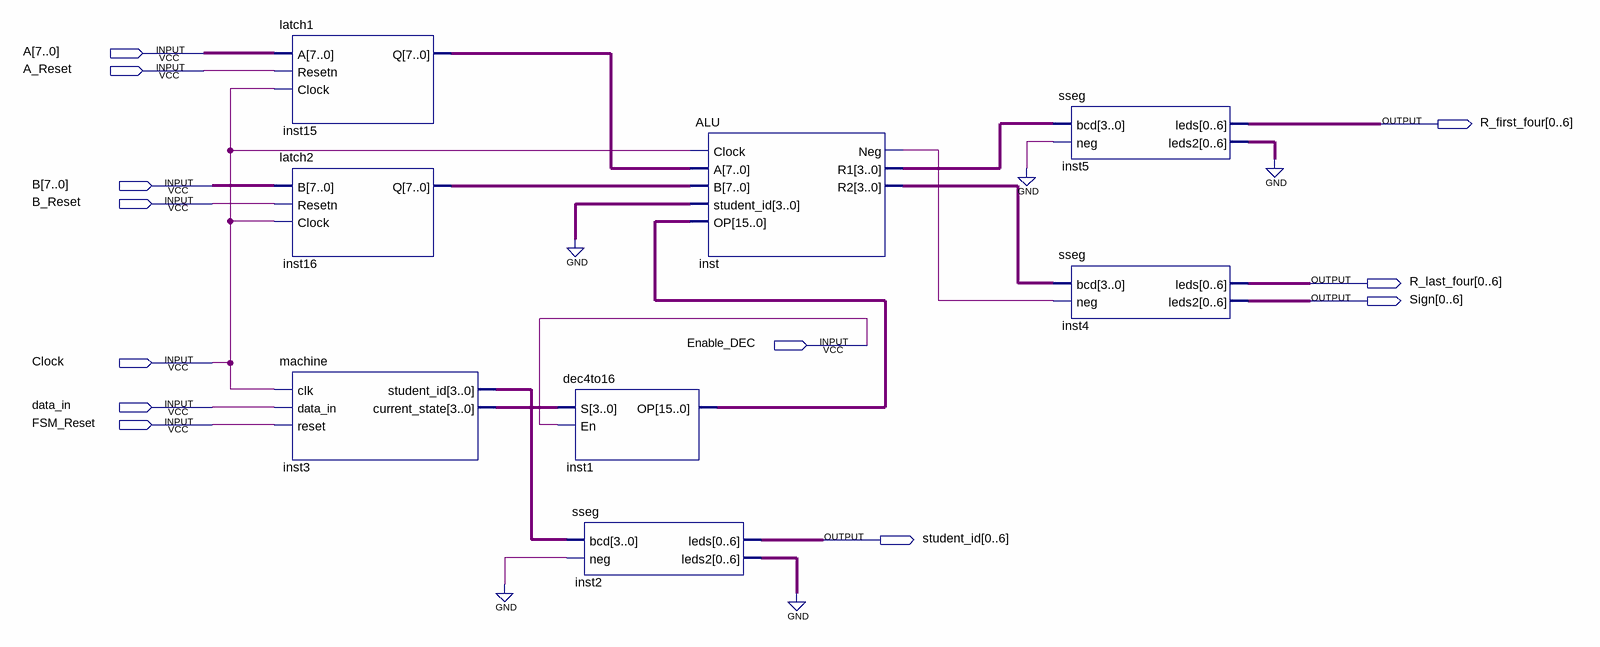
[diagram p0: schematic sheet]
// Quartus schematic gpu.bdf as structural Verilog: 8 symbols, 12 pins
module gpu (
  input  [7:0] A,
  input  A_Reset,
  input  [7:0] B,
  input  B_Reset,
  input  Enable_DEC,
  input  Clock,
  input  data_in,
  input  FSM_Reset,
  output [0:6] R_first_four,
  output [0:6] R_last_four,
  output [0:6] Sign,
  output [0:6] student_id
);

  wire inst_neg;
  wire [3:0] inst3_current_state, inst3_student_id, inst_r1, inst_r2;
  wire [6:0] inst2_leds2, inst5_leds2;
  wire [7:0] inst15_q, inst16_q;
  wire [15:0] inst1_op;

  latch1 inst15 (.A(A), .Resetn(A_Reset), .Clock(Clock), .Q(inst15_q));
  latch2 inst16 (.B(B), .Resetn(B_Reset), .Clock(Clock), .Q(inst16_q));
  machine inst3 (
    .clk(Clock), .data_in(data_in), .reset(FSM_Reset), .student_id(inst3_student_id),
    .current_state(inst3_current_state));
  dec4to16 inst1 (.S(inst3_current_state), .En(Enable_DEC), .OP(inst1_op));
  sseg inst2 (.bcd(inst3_student_id), .neg(1'b0), .leds(student_id), .leds2(inst2_leds2));
  ALU inst (
    .Clock(Clock), .A(inst15_q), .B(inst16_q), .student_id(4'b0000), .OP(inst1_op), .Neg(inst_neg),
    .R1(inst_r1), .R2(inst_r2));
  sseg inst5 (.bcd(inst_r1), .neg(1'b0), .leds(R_first_four), .leds2(inst5_leds2));
  sseg inst4 (.bcd(inst_r2), .neg(inst_neg), .leds(R_last_four), .leds2(Sign));
  // also tied to GND on the sheet: {inst2_leds2[0], inst2_leds2[1], inst2_leds2[2], inst2_leds2[3], inst2_leds2[4], inst2_leds2[5], inst2_leds2[6], inst5_leds2[0], inst5_leds2[1], inst5_leds2[2], inst5_leds2[3], inst5_leds2[4], inst5_leds2[5], inst5_leds2[6]}
endmodule
